# Altium schematic sheet CurrentDriver.SchDoc
size A
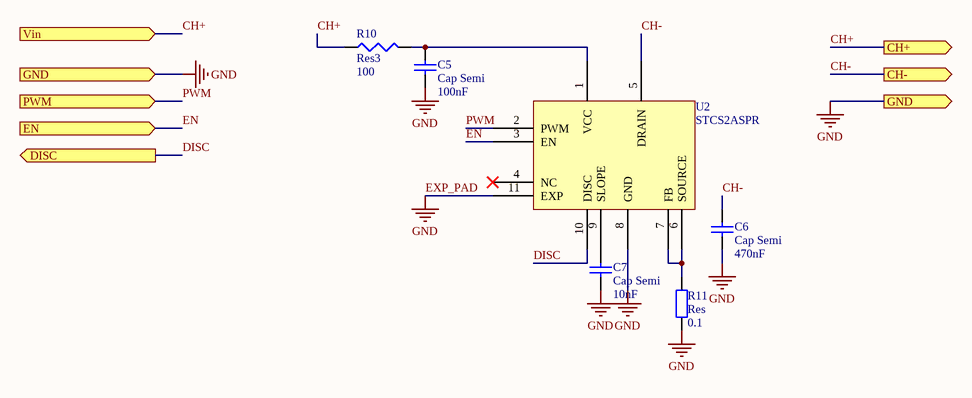
[diagram p0: CurrentDriver.SchDoc]

## Parts
C5  Cap Semi  value 100nF  [1608[0603]]
C6  Cap Semi  value 470nF  [1608[0603]]
C7  Cap Semi  value 10nF  [1608[0603]]
R10  Res3  value 100  [J1-0603]
R11  Res  value 0.1  [2512]
U2  STCS2ASPR  [PowerSO-10]

## Ports
CH+ (out), CH- (out), DISC (out), EN (in), GND (in), GND (out), PWM (in), Vin (in)

## Nets
EXP_PAD: C5.2 C6.2 C7.2 R11.1 U2.8(GND) U2.11(EXP) ; port GND  [also labelled GND]
CH+: R10.2 ; port Vin, port CH+
CH-: C6.1 U2.5(DRAIN) ; port CH-
DISC: U2.10(DISC) ; port DISC
EN: U2.3(EN) ; port EN
PWM: U2.2(PWM) ; port PWM
NetC5_1: C5.1 R10.1 U2.1(VCC)
NetC7_1: C7.1 U2.9(SLOPE)
NetR11_2: R11.2 U2.6(SOURCE) U2.7(FB)

Not connected (* = marked no-connect by the designer): U2 4(NC)*

## Library data of the parts
C5-C7 = Cap Semi: Capacitor (Semiconductor SIM Model); Published: 8-Jun-2000; LatestRevisionDate: 29-May-2009; LatestRevisionNote: IPC-7351 Footprint Added.; PackageReference: C1206; Publisher: Altium Limited; PackageDescription: Chip Capacitor; Supplier 1: Digi-Key
  C5: Supplier Part Number 1: 1276-1857-1-ND
  C6: Supplier Part Number 1: 490-4775-1-ND
  C7: Supplier Part Number 1: 311-1360-1-ND
R10 = Res3: Resistor; Published: 8-Jun-2000; LatestRevisionDate: 29-May-2009; LatestRevisionNote: IPC-7351 Footprint Added.; PackageReference: J1-0603; Publisher: Altium Limited; PackageDescription: Chip Resistor; Supplier 1: Digi-Key; Supplier Part Number 1: P120DBCT-ND
R11 = Res: Generic resistor; Supplier 1: Digi-Key; Supplier Part Number 1: 311-0.1TCT-ND
U2 = STCS2A: LED CURRENT DRIVER; Supplier 1: Digi-Key; Supplier Part Number 1: 497-6917-1-ND